# Altium schematic sheet clock.SchDoc
size 297 x 209 mm
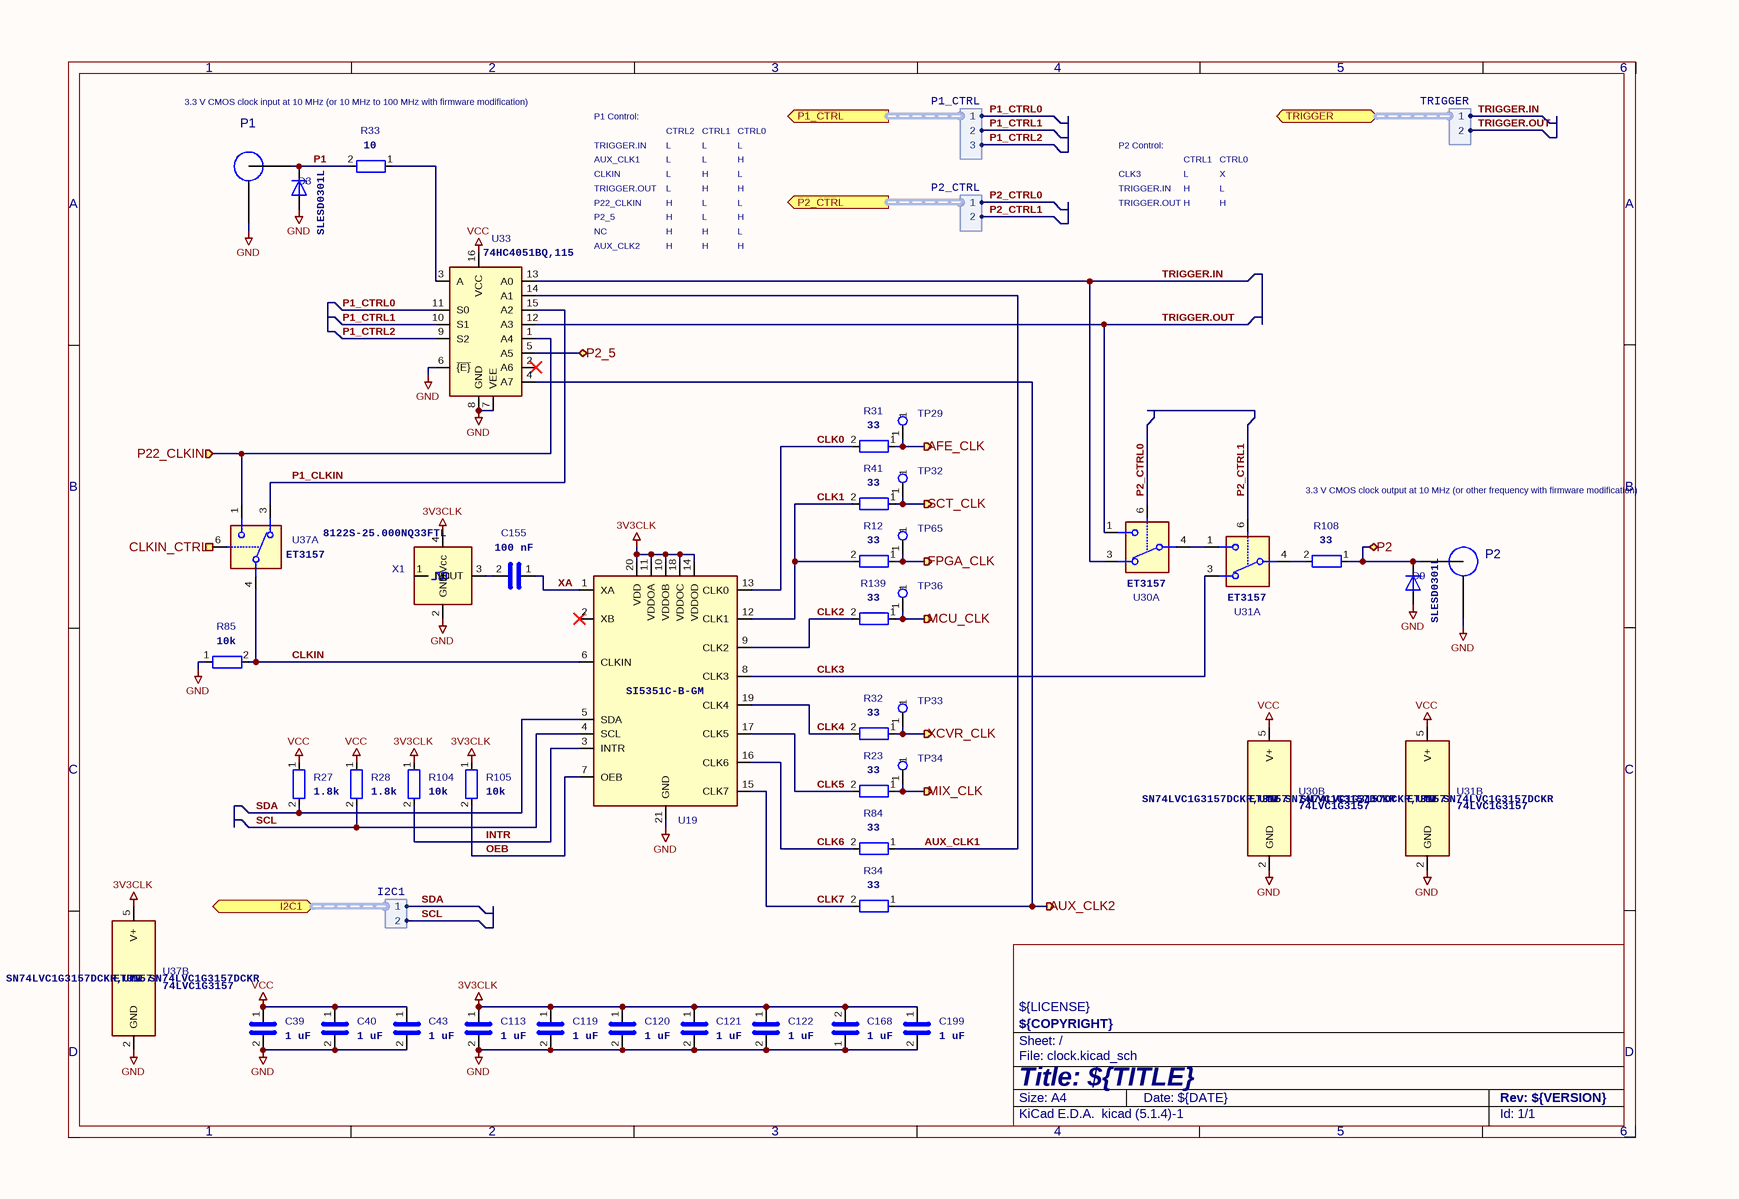
[diagram p0: clock.SchDoc]

## Parts
C39  1 uF  [C_0402_1005Metric]
C40  1 uF  [C_0402_1005Metric]
C43  1 uF  [C_0402_1005Metric]
C113  1 uF  [C_0402_1005Metric]
C119  1 uF  [C_0402_1005Metric]
C120  1 uF  [C_0402_1005Metric]
C121  1 uF  [C_0402_1005Metric]
C122  1 uF  [C_0402_1005Metric]
C155  100 nF  [C_0402_1005Metric]
C168  1 uF  [C_0402_1005Metric]
C199  1 uF  [C_0402_1005Metric]
D3  Part Number: SLESD0301L  [TSLP-2-19]  (hidden comment: TVS)
D9  Part Number: SLESD0301L  [TSLP-2-19]  (hidden comment: TVS)
P1  SMA  [SMA_MyAntenna_A-SMA-KE-16.5A_EdgeMount]  (value not drawn)
P2  SMA  [SMA_MyAntenna_A-SMA-KE-16.5A_EdgeMount]  (value not drawn)
R12  33  [R_0201_0603Metric]
R23  33  [R_0201_0603Metric]
R27  1.8k  [R_0402_1005Metric]
R28  1.8k  [R_0402_1005Metric]
R31  33  [R_0201_0603Metric]
R32  33  [R_0201_0603Metric]
R33  10  [R_0201_0603Metric]
R34  33  [R_0201_0603Metric]
R41  33  [R_0201_0603Metric]
R84  33  [R_0201_0603Metric]
R85  10k  [R_0402_1005Metric]
R104  10k  [R_0402_1005Metric]
R105  10k  [R_0402_1005Metric]
R108  33  [R_0201_0603Metric]
R139  33  [R_0201_0603Metric]
TP29  TestPoint  [TestPoint_Pad_D1.0mm]  (value not drawn)
TP32  TestPoint  [TestPoint_Pad_D1.0mm]  (value not drawn)
TP33  TestPoint  [TestPoint_Pad_D1.0mm]  (value not drawn)
TP34  TestPoint  [TestPoint_Pad_D1.0mm]  (value not drawn)
TP36  TestPoint  [TestPoint_Pad_D1.0mm]  (value not drawn)
TP65  TestPoint  [TestPoint_Pad_D1.0mm]  (value not drawn)
U19  SI5351C  [QFN-20-1EP_4x4mm_P0.5mm_EP2.7x2.7mm_ThermalVias]  (value not drawn)
U30  Part Number: ET3157  [SOT-363_SC-70-6]  (hidden comment: 74LVC1G3157)  (parts A,B of 2)
U31  Part Number: ET3157  [SOT-363_SC-70-6]  (hidden comment: 74LVC1G3157)  (parts A,B of 2)
U33  Part Number: 74HC4051BQ,115  [DHVQFN-16-1EP_2.5x3.5mm_P0.5mm_EP1x2mm]  (hidden comment: 74HC4051)
U37  Part Number: ET3157  [SOT-363_SC-70-6]  (hidden comment: 74LVC1G3157)  (parts A,B of 2)
X1  Part Number: 8122S-25.000NQ33FTL  [Oscillator_SMD_SeikoEpson_TG2520SMN-xxx-xxxxxx-4Pin_2.5x2.0mm]  (hidden comment: TCXO)

## Ports
AFE_CLK (out), AUX_CLK2 (out), CLKIN_CTRL (in), FPGA_CLK (out), I2C1 (bidir, harness I2C1), MCU_CLK (out), MIX_CLK (out), P1_CTRL (out, harness P1_CTRL), P2 (bidir), P2_5 (bidir), P2_CTRL (out, harness P2_CTRL), P22_CLKIN (in), SCT_CLK (out), TRIGGER (bidir, harness TRIGGER), XCVR_CLK (out)

## Harnesses
P1_CTRL: 1, 2, 3
P2_CTRL: 1, 2
TRIGGER: 1, 2
I2C1: 1, 2

## Nets
3V3CLK: C113.1 C119.1 C120.1 C121.1 C122.1 C168.2 C199.1 R104.1 R105.1 U19.10(VDDOB) U19.11(VDDOA) U19.14(VDDOD) U19.18(VDDOC) U19.20(VDD) U37.5(V+) X1.4(Vcc)
GND: C39.2 C40.2 C43.2 C113.2 C119.2 C120.2 C121.2 C122.2 C168.1 C199.2 D3.2(A) D9.2(A) P1.2(GND) P2.2(GND) R85.1 U19.21(GND) U30.2(GND) U31.2(GND) U33.6(~{{E}}) U33.7(VEE) U33.8(GND) U37.2(GND) X1.2(GND)
VCC: C39.1 C40.1 C43.1 R27.1 R28.1 U30.5(V+) U31.5(V+) U33.16(VCC)
AFE_CLK: R31.1 TP29.1 ; port AFE_CLK
AUX_CLK1: R84.1 U33.14(A1)
AUX_CLK2: R34.1 U33.4(A7) ; port AUX_CLK2
CLK0: R31.2 U19.13(CLK0)
CLK1: R12.2 R41.2 U19.12(CLK1)
CLK2: R139.2 U19.9(CLK2)
CLK3: U19.8(CLK3) U31.3
CLK4: R32.2 U19.19(CLK4)
CLK5: R23.2 U19.17(CLK5)
CLK6: R84.2 U19.16(CLK6)
CLK7: R34.2 U19.15(CLK7)
CLKIN: R85.2 U19.6(CLKIN) U37.4
CLKIN_CTRL: U37.6 ; port CLKIN_CTRL
FPGA_CLK: R12.1 TP65.1 ; port FPGA_CLK
INTR: R104.2 U19.3(INTR)
MCU_CLK: R139.1 TP36.1 ; port MCU_CLK
MIX_CLK: R23.1 TP34.1 ; port MIX_CLK
OEB: R105.2 U19.7(OEB)
P1: D3.1(K) P1.1(RF) R33.2
P1_CLKIN: U33.15(A2) U37.3
P1_CTRL0: U33.11(S0) ; port P1_CTRL.1
P1_CTRL1: U33.10(S1) ; port P1_CTRL.2
P1_CTRL2: U33.9(S2) ; port P1_CTRL.3
P2: D9.1(K) P2.1(RF) R108.1 ; port P2
P2_5: U33.5(A5) ; port P2_5
P2_CTRL0: U30.6 ; port P2_CTRL.1
P2_CTRL1: U31.6 ; port P2_CTRL.2
P22_CLKIN: U33.1(A4) U37.1 ; port P22_CLKIN
SCL: R28.2 U19.4(SCL) ; port I2C1.2
SCT_CLK: R41.1 TP32.1 ; port SCT_CLK
SDA: R27.2 U19.5(SDA) ; port I2C1.1
TRIGGER.IN: U30.3 U33.13(A0) ; port TRIGGER.1
TRIGGER.OUT: U30.1 U33.12(A3) ; port TRIGGER.2
XA: C155.1 U19.1(XA)
XCVR_CLK: R32.1 TP33.1 ; port XCVR_CLK
NetC155_2: C155.2 X1.3(OUT)
NetR33_1: R33.1 U33.3(A)
NetR108_2: R108.2 U31.4
NetU30_4: U30.4 U31.1

Not connected (* = marked no-connect by the designer): U19 2(XB)*; U33 2(A6)*; X1 1(NC)

## Notes on the sheet
- 3.3 V CMOS clock input at 10 MHz
  (or 10 MHz to 100 MHz with firmware modification)
- P1 Control:
- CTRL2
- CTRL1
- CTRL0
- TRIGGER.OUT
- P2_5
- TRIGGER.IN
- AUX_CLK1
- P22_CLKIN
- CLKIN
- L
- H
- CLK3
- P2 Control:
- X
- NC
- AUX_CLK2
- 3.3 V CMOS clock output at 10 MHz
  (or other frequency with firmware modification)
- 1
- 2
- 3
- 4
- 5
- 6
- A
- B
- C
- ${LICENSE}
- D
- Title: ${TITLE}
- File: clock.kicad_sch
- Sheet: /
- ${COPYRIGHT}
- KiCad E.D.A.  kicad (5.1.4)-1
- Size: A4
- Date: ${DATE}
- Rev: ${VERSION}
- Id: 1/1

## Library data of the parts
C39 C40 C43 C113 C119-C122 C168 C199 = C: Manufacturer: Samsung; Part Number: CL05A105KA5NQNC; Substitution: Murata GRM155R61E105KA12D; Value: 1 uF; Footprint: Capacitor_SMD:C_0402_1005Metric
C155 = C: Manufacturer: Samsung; Part Number: CL05A104KA5NNNC; Substitution: Murata GRM155R61A104KA01D; Value: 100 nF; Footprint: Capacitor_SMD:C_0402_1005Metric
D3 D9 = D_Zener: Manufacturer: Slkor; Value: TVS; Footprint: praline:TSLP-2-19
P1 P2 = GSG-RF-CONN: Manufacturer: MyAntenna; Part Number: A-SMA-KE-16.5A; Substitution: M04-0102170R0A; Value: SMA; Footprint: praline:SMA_MyAntenna_A-SMA-KE-16.5A_EdgeMount
R12 R23 R31 R32 R34 R41 R84 R108 R139 = R: Manufacturer: Yageo; Part Number: RC0201JR-0733RL; Substitution: any equivalent; Value: 33; Footprint: Resistor_SMD:R_0201_0603Metric
R27 R28 = R: Manufacturer: Yageo; Part Number: RC0402JR-071K8L; Substitution: any equivalent; Value: 1.8k; Footprint: Resistor_SMD:R_0402_1005Metric
R33 = R: Manufacturer: Yageo; Part Number: RC0201JR-0710RL; Substitution: any equivalent; Value: 10; Footprint: Resistor_SMD:R_0201_0603Metric
R85 R104 R105 = R: Manufacturer: Yageo; Part Number: RC0402JR-0710KL; Substitution: any equivalent; Value: 10k; Footprint: Resistor_SMD:R_0402_1005Metric
U19 = Si5351C-B-GM: Manufacturer: Silicon Laboratories Inc; Substitution: SI5351C-B-GM*; Part Number: SI5351C-B-GM; Value: SI5351C; Footprint: praline:QFN-20-1EP_4x4mm_P0.5mm_EP2.7x2.7mm_ThermalVias
U30 U31 U37 = NC7SB3157P6X: Manufacturer: UMW; Substitution: SN74LVC1G3157DCKR, TI SN74LVC1G3157DCKR; Value: 74LVC1G3157; Footprint: Package_TO_SOT_SMD:SOT-363_SC-70-6
U33 = 74HC4051: Manufacturer: Nexperia; Value: 74HC4051; Footprint: Package_DFN_QFN:DHVQFN-16-1EP_2.5x3.5mm_P0.5mm_EP1x2mm
X1 = TG2520SMN-xx.xxxxxxMhz-xxxxNM: Manufacturer: HCI; Value: TCXO; Footprint: praline:Oscillator_SMD_SeikoEpson_TG2520SMN-xxx-xxxxxx-4Pin_2.5x2.0mm
TP29 TP32-TP34 TP36 TP65 = TestPoint: Value: TestPoint; Footprint: TestPoint:TestPoint_Pad_D1.0mm